# EAGLE design base (EAGLE 9.6.2)

## Sheet 1 of 3
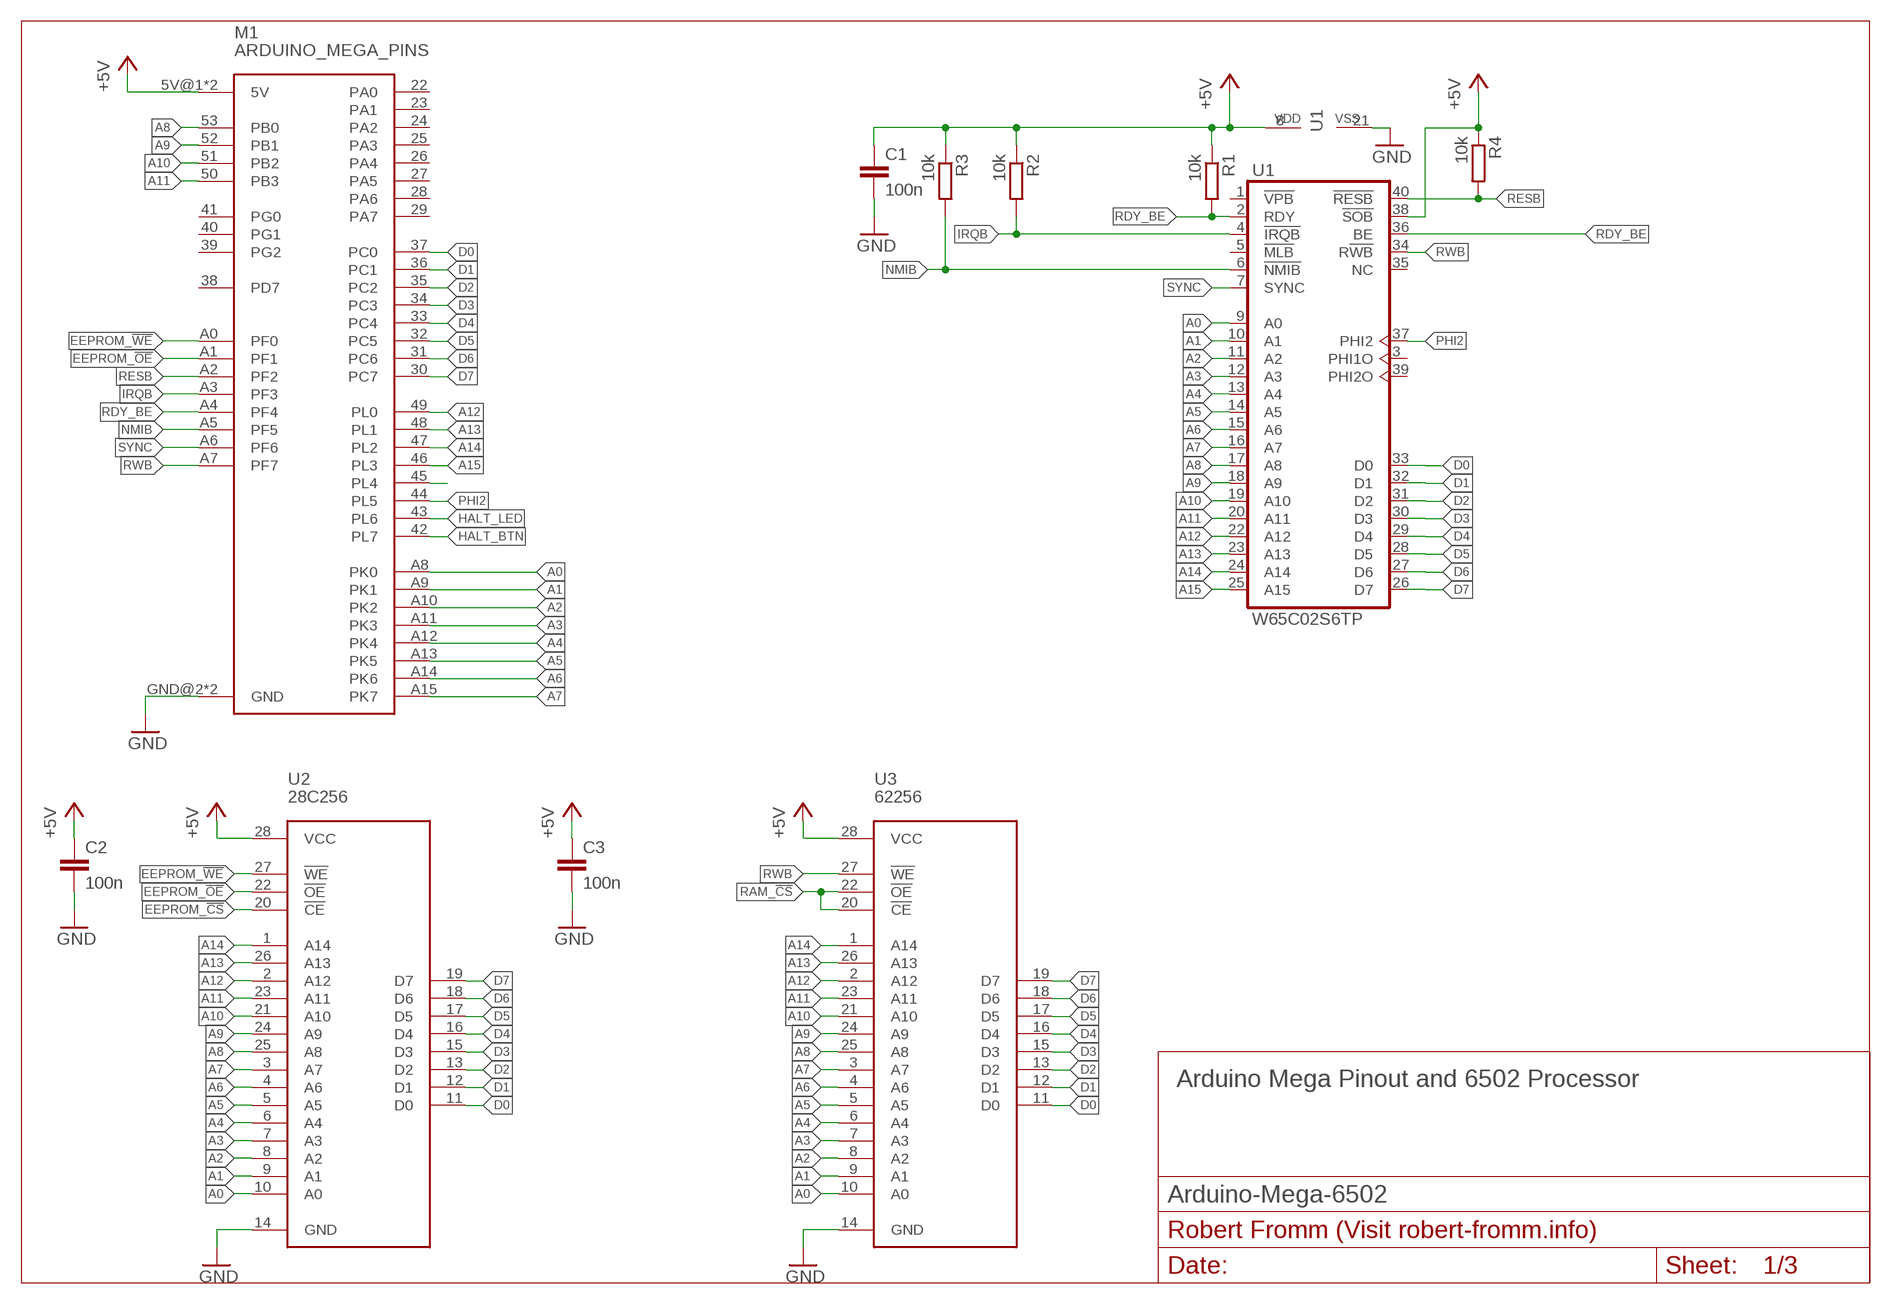
[diagram p0: schematic, sheet 1]

### Parts
C1  100n  C-EUC0805  [C0805]
C2  100n  C-EUC0805  [C0805]
C3  100n  C-EUC0805  [C0805]
M1  ARDUINO_MEGA_PINS  [ARDUINO_MEGA_PINS]
R1  10k  R-EU_R0805  [R0805]
R2  10k  R-EU_R0805  [R0805]
R3  10k  R-EU_R0805  [R0805]
R4  10k  R-EU_R0805  [R0805]
U1  W65C02S6TP  [DIL40]
U2  28C256  [DIL28-6]
U3  62256  [DIL28-6]

### Nets
+5V: C1.1 C2.1 C3.1 M1.5V@1(5V) M1.5V@2(5V) R1.1 R2.1 R3.1 R4.1 U1.8(P:VDD) U1.38(1:!SOB) U2.28(VCC) U3.28(VCC) ; also sheet 2,3
A0: M1.A8(PK0) U1.9(1:A0) U2.10(A0) U3.10(A0) ; also sheet 3
A1: M1.A9(PK1) U1.10(1:A1) U2.9(A1) U3.9(A1) ; also sheet 3
A2: M1.A10(PK2) U1.11(1:A2) U2.8(A2) U3.8(A2) ; also sheet 3
A3: M1.A11(PK3) U1.12(1:A3) U2.7(A3) U3.7(A3) ; also sheet 3
A4: M1.A12(PK4) U1.13(1:A4) U2.6(A4) U3.6(A4) ; also sheet 3
A5: M1.A13(PK5) U1.14(1:A5) U2.5(A5) U3.5(A5) ; also sheet 3
A6: M1.A14(PK6) U1.15(1:A6) U2.4(A6) U3.4(A6) ; also sheet 3
A7: M1.A15(PK7) U1.16(1:A7) U2.3(A7) U3.3(A7) ; also sheet 3
A8: M1.53(PB0) U1.17(1:A8) U2.25(A8) U3.25(A8) ; also sheet 3
A9: M1.52(PB1) U1.18(1:A9) U2.24(A9) U3.24(A9) ; also sheet 3
A10: M1.51(PB2) U1.19(1:A10) U2.21(A10) U3.21(A10) ; also sheet 3
A11: M1.50(PB3) U1.20(1:A11) U2.23(A11) U3.23(A11) ; also sheet 3
A12: M1.49(PL0) U1.22(1:A12) U2.2(A12) U3.2(A12) ; also sheet 2,3
A13: M1.48(PL1) U1.23(1:A13) U2.26(A13) U3.26(A13) ; also sheet 2,3
A14: M1.47(PL2) U1.24(1:A14) U2.1(A14) U3.1(A14) ; also sheet 2,3
A15: M1.46(PL3) U1.25(1:A15) ; also sheet 2,3
D0: M1.37(PC0) U1.33(1:D0) U2.11(D0) U3.11(D0) ; also sheet 3
D1: M1.36(PC1) U1.32(1:D1) U2.12(D1) U3.12(D1) ; also sheet 3
D2: M1.35(PC2) U1.31(1:D2) U2.13(D2) U3.13(D2) ; also sheet 3
D3: M1.34(PC3) U1.30(1:D3) U2.15(D3) U3.15(D3) ; also sheet 3
D4: M1.33(PC4) U1.29(1:D4) U2.16(D4) U3.16(D4) ; also sheet 3
D5: M1.32(PC5) U1.28(1:D5) U2.17(D5) U3.17(D5) ; also sheet 3
D6: M1.31(PC6) U1.27(1:D6) U2.18(D6) U3.18(D6) ; also sheet 3
D7: M1.30(PC7) U1.26(1:D7) U2.19(D7) U3.19(D7) ; also sheet 3
EEPROM_!CS: U2.20(!CE) ; also sheet 2
EEPROM_!OE: M1.A1(PF1) U2.22(!OE)
EEPROM_!WE: M1.A0(PF0) U2.27(!WE)
GND: C1.2 C2.2 C3.2 M1.GND@2(GND) M1.GND@3(GND) U1.21(P:VSS) U2.14(GND) U3.14(GND) ; also sheet 2,3
HALT_BTN: M1.42(PL7) ; also sheet 3
HALT_LED: M1.43(PL6) ; also sheet 3
IRQB: M1.A3(PF3) R2.2 U1.4(1:!IRQB) ; also sheet 3
N$6: M1.45(PL4)
NMIB: M1.A5(PF5) R3.2 U1.6(1:!NMIB) ; also sheet 3
PHI2: M1.44(PL5) U1.37(1:PHI2) ; also sheet 2,3
RAM_!CS: U3.20(!CE) U3.22(!OE) ; also sheet 2
RDY_BE: M1.A4(PF4) R1.2 U1.2(1:RDY) U1.36(1:BE)
RESB: M1.A2(PF2) R4.2 U1.40(1:!RESB) ; also sheet 3
RWB: M1.A7(PF7) U1.34(1:R!WB) U3.27(!WE) ; also sheet 3
SYNC: M1.A6(PF6) U1.7(1:SYNC) ; also sheet 3
Unconnected: M1.22(PA0) M1.23(PA1) M1.24(PA2) M1.25(PA3) M1.26(PA4) M1.27(PA5) M1.28(PA6) M1.29(PA7) M1.38(PD7) M1.39(PG2) M1.40(PG1) M1.41(PG0) U1.1(1:!VPB) U1.3(1:PHI1O) U1.5(1:!MLB) U1.35(1:NC) U1.39(1:PHI2O)

### Notes on the sheet
- Arduino Mega Pinout and 6502 Processor

## Sheet 2 of 3
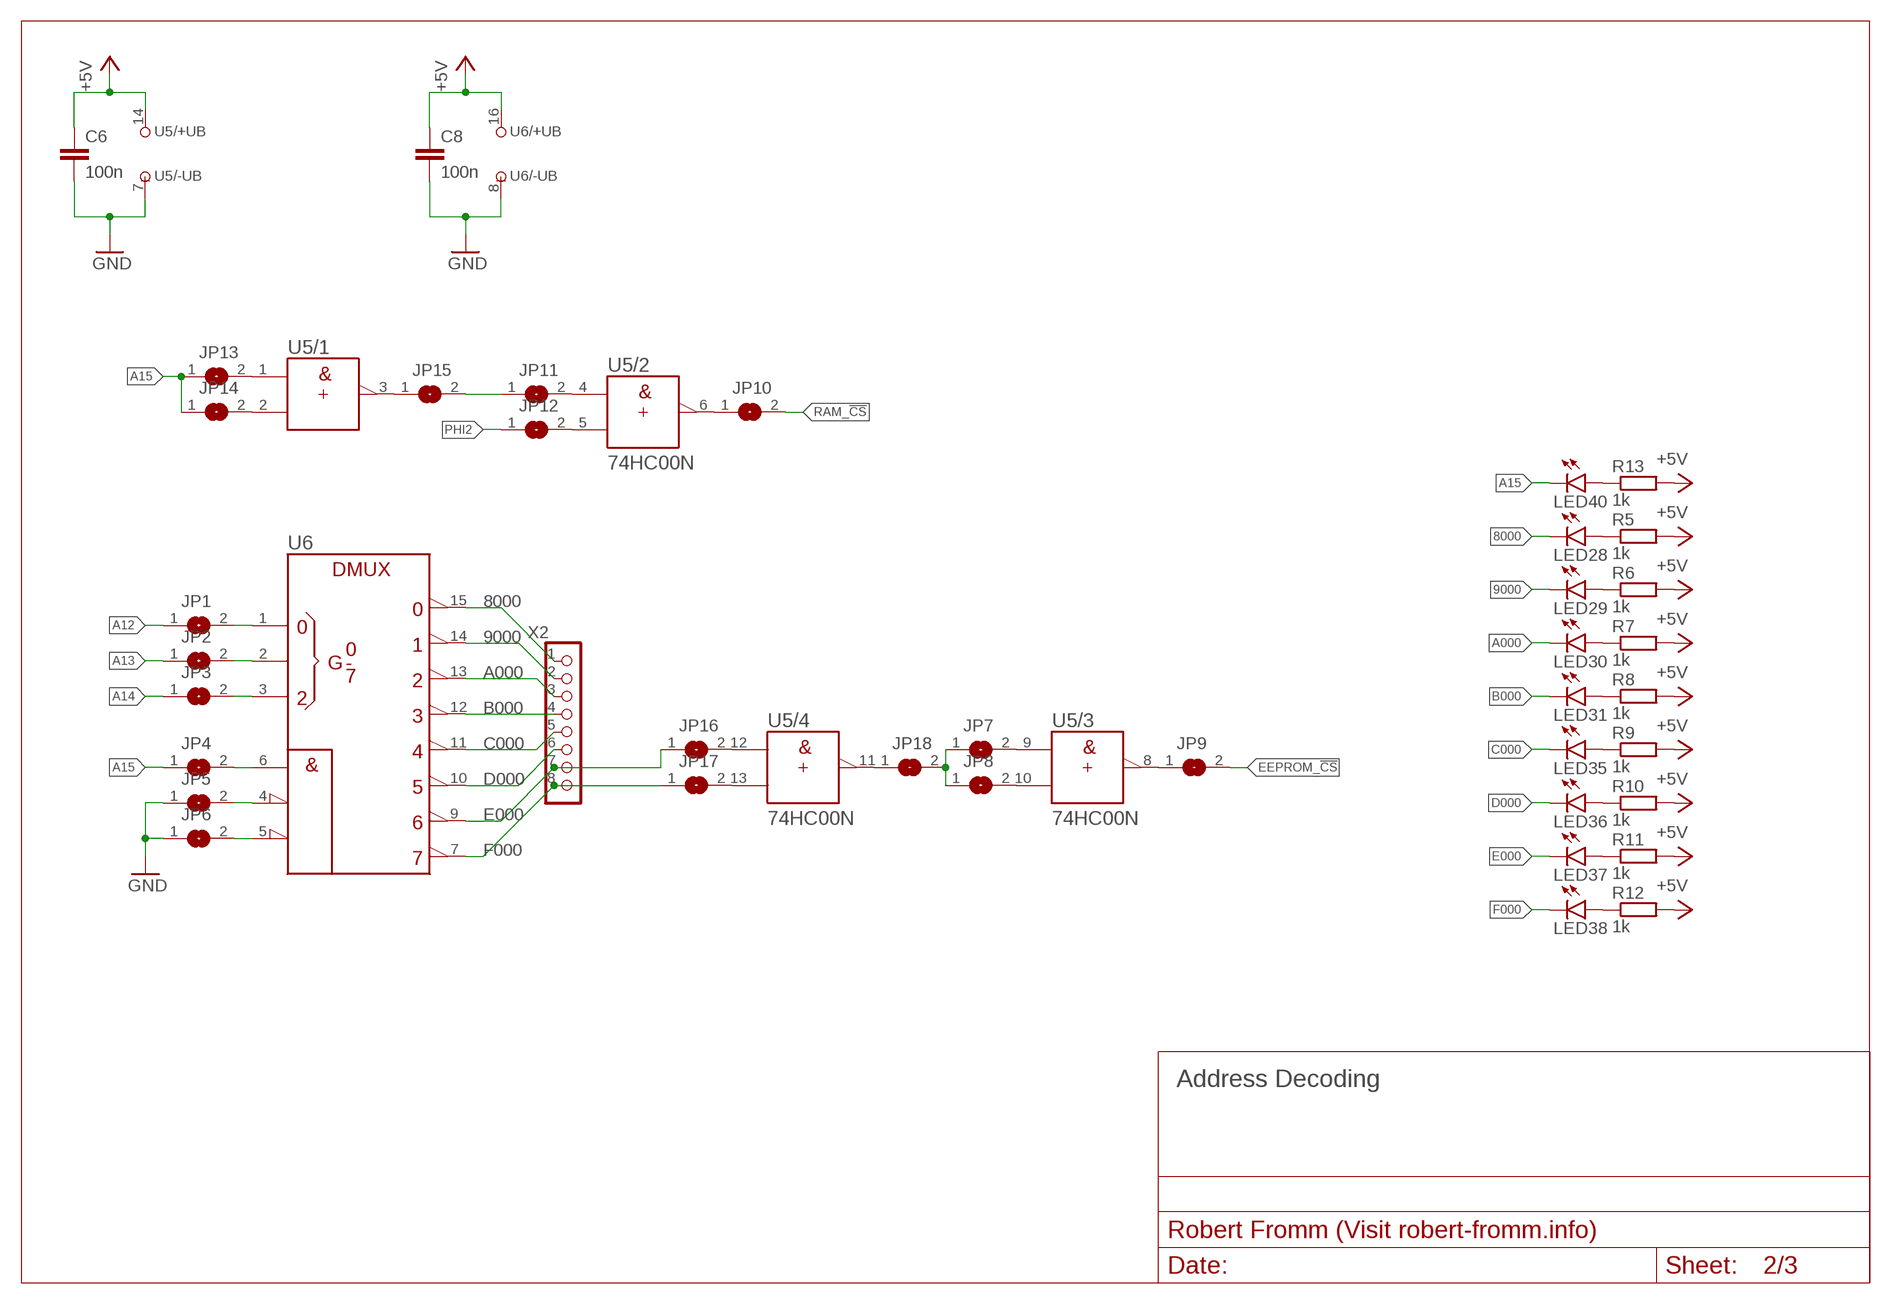
[diagram p1: schematic, sheet 2]

### Parts
C6  100n  C-EUC0805  [C0805]
C8  100n  C-EUC0805  [C0805]
JP1  SJ  [SJ]
JP2  SJ  [SJ]
JP3  SJ  [SJ]
JP4  SJ  [SJ]
JP5  SJ  [SJ]
JP6  SJ  [SJ]
JP7  SJ  [SJ]
JP8  SJ  [SJ]
JP9  SJ  [SJ]
JP10  SJ  [SJ]
JP11  SJ  [SJ]
JP12  SJ  [SJ]
JP13  SJ  [SJ]
JP14  SJ  [SJ]
JP15  SJ  [SJ]
JP16  SJ  [SJ]
JP17  SJ  [SJ]
JP18  SJ  [SJ]
LED28  LEDSML0805  [SML0805]
LED29  LEDSML0805  [SML0805]
LED30  LEDSML0805  [SML0805]
LED31  LEDSML0805  [SML0805]
LED35  LEDSML0805  [SML0805]
LED36  LEDSML0805  [SML0805]
LED37  LEDSML0805  [SML0805]
LED38  LEDSML0805  [SML0805]
LED40  LEDSML0805  [SML0805]
R5  1k  R-EU_R0805  [R0805]
R6  1k  R-EU_R0805  [R0805]
R7  1k  R-EU_R0805  [R0805]
R8  1k  R-EU_R0805  [R0805]
R9  1k  R-EU_R0805  [R0805]
R10  1k  R-EU_R0805  [R0805]
R11  1k  R-EU_R0805  [R0805]
R12  1k  R-EU_R0805  [R0805]
R13  1k  R-EU_R0805  [R0805]
U5  74HC00N  [DIL14]
U6  74138N  [DIL16]
X2  PINHD_8_RND  [1X08]

### Nets
8000: LED28.C U6.15(Y0) X2.1
9000: LED29.C U6.14(Y1) X2.2
+5V: C6.1 C8.1 R5.2 R6.2 R7.2 R8.2 R9.2 R10.2 R11.2 R12.2 R13.2 U5.14(/+UB:+UB) U6.16(+UB) ; also sheet 1,3
A000: LED30.C U6.13(Y2) X2.3
A12: JP1.1 ; also sheet 1,3
A13: JP2.1 ; also sheet 1,3
A14: JP3.1 ; also sheet 1,3
A15: JP4.1 JP13.1 JP14.1 LED40.C ; also sheet 1,3
B000: LED31.C U6.12(Y3) X2.4
C000: LED35.C U6.11(Y4) X2.5
D000: LED36.C U6.10(Y5) X2.6
E000: JP16.1 LED37.C U6.9(Y6) X2.7
EEPROM_!CS: JP9.2 ; also sheet 1
F000: JP17.1 LED38.C U6.7(Y7) X2.8
GND: C6.2 C8.2 JP5.1 JP6.1 U5.7(/-UB:-UB) U6.8(-UB) ; also sheet 1,3
N$1: LED40.A R13.1
N$9: JP7.2 U5.9(/3:A)
N$10: JP8.2 U5.10(/3:B)
N$11: JP9.1 U5.8(/3:Y)
N$12: JP1.2 U6.1(A)
N$13: JP2.2 U6.2(B)
N$14: JP3.2 U6.3(C)
N$15: JP5.2 U6.4(!G2A)
N$16: JP6.2 U6.5(!G2B)
N$17: JP4.2 U6.6(G1)
N$18: JP17.2 U5.13(/4:B)
N$19: JP10.1 U5.6(/2:Y)
N$20: JP13.2 U5.1(/1:A)
N$21: JP14.2 U5.2(/1:B)
N$49: JP15.1 U5.3(/1:Y)
N$50: JP18.1 U5.11(/4:Y)
N$51: JP11.1 JP15.2
N$52: JP16.2 U5.12(/4:A)
N$53: JP7.1 JP8.1 JP18.2
N$55: JP11.2 U5.4(/2:A)
N$56: JP12.2 U5.5(/2:B)
N$57: LED28.A R5.1
N$58: LED29.A R6.1
N$59: LED30.A R7.1
N$60: LED31.A R8.1
N$61: LED35.A R9.1
N$62: LED36.A R10.1
N$63: LED37.A R11.1
N$64: LED38.A R12.1
PHI2: JP12.1 ; also sheet 1,3
RAM_!CS: JP10.2 ; also sheet 1

### Notes on the sheet
- Address Decoding

## Sheet 3 of 3
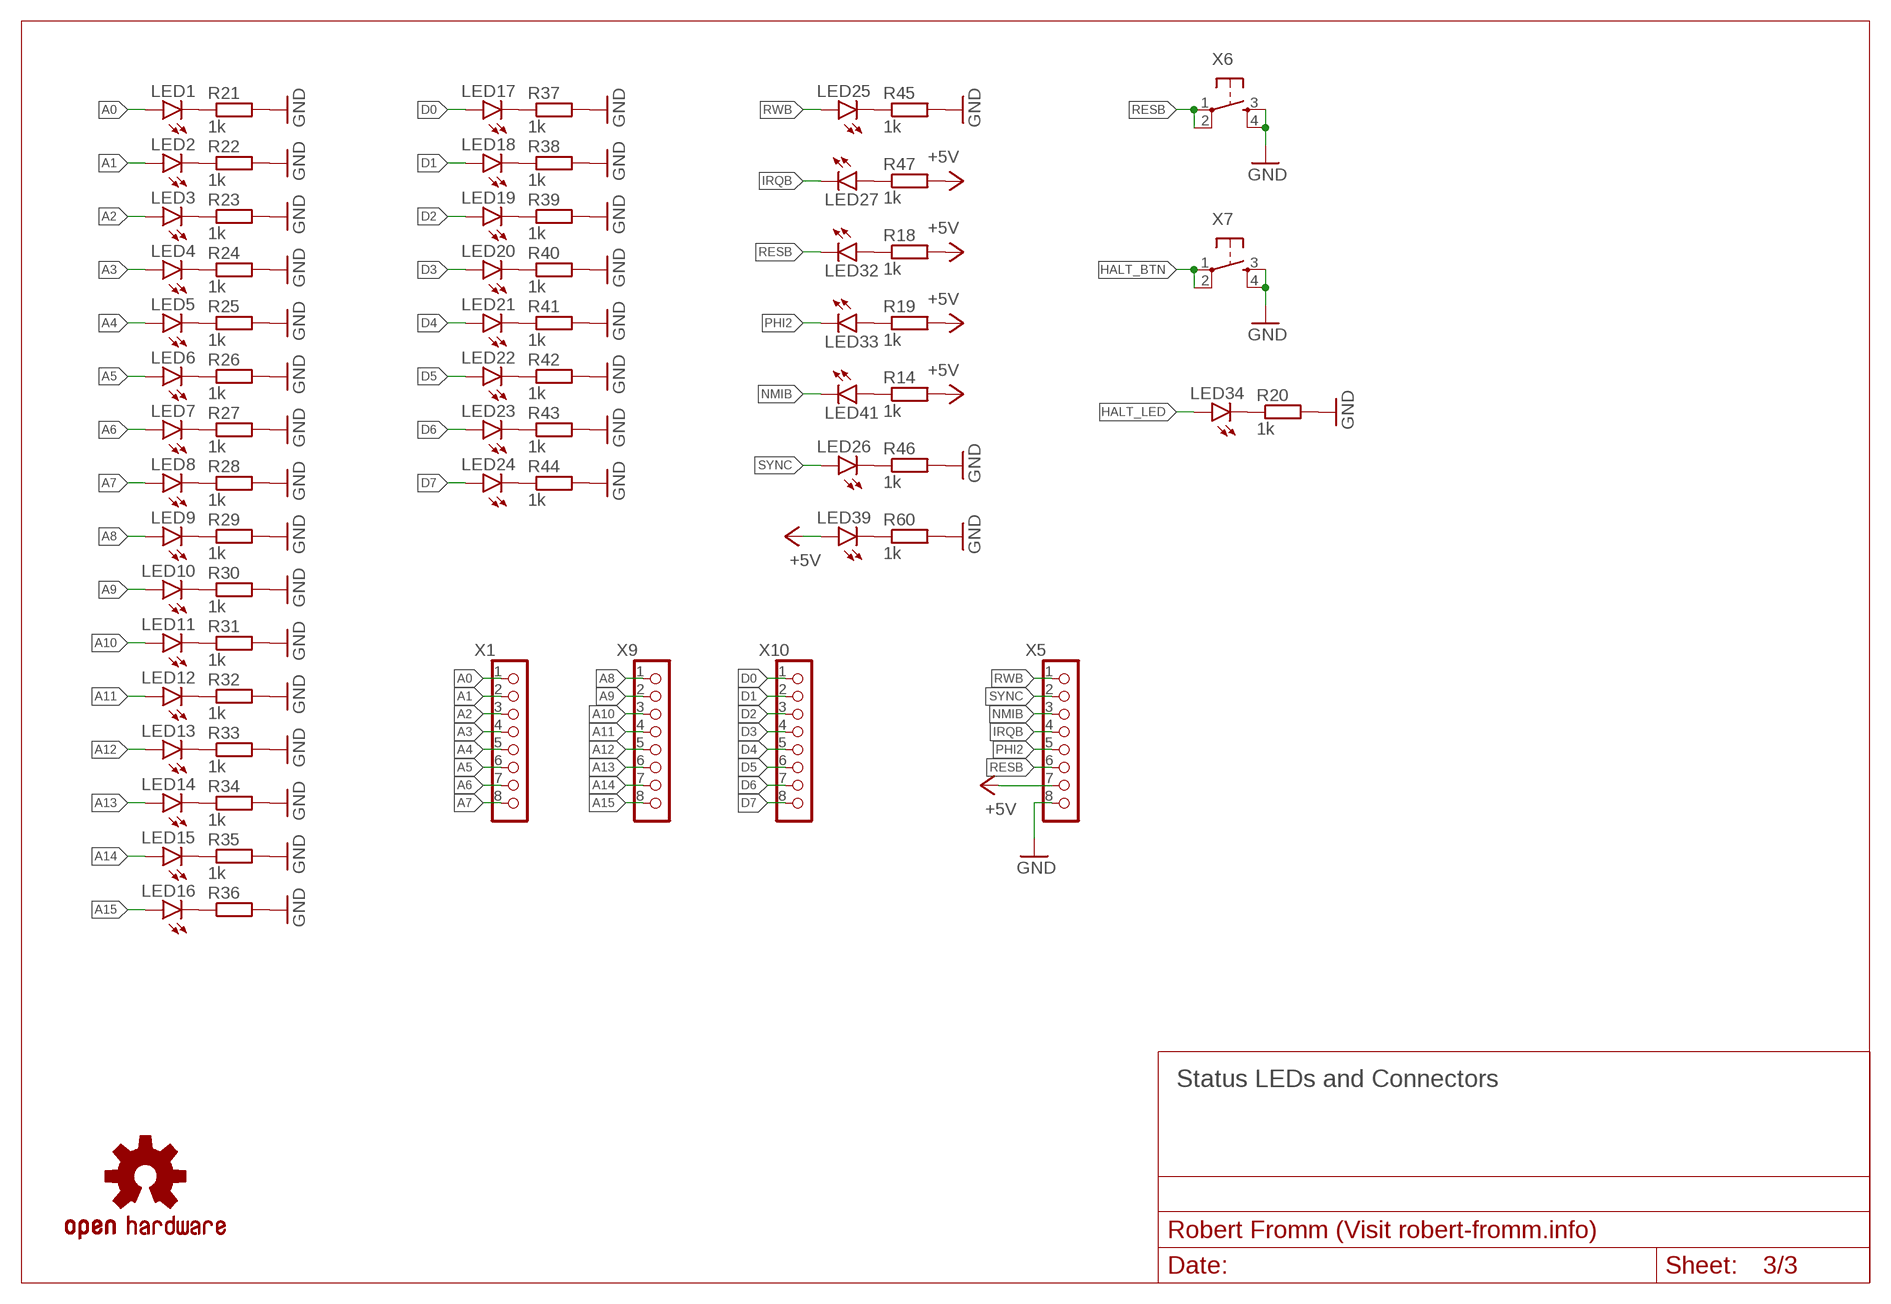
[diagram p2: schematic, sheet 3]

### Parts
LED1  LEDSML0805  [SML0805]
LED2  LEDSML0805  [SML0805]
LED3  LEDSML0805  [SML0805]
LED4  LEDSML0805  [SML0805]
LED5  LEDSML0805  [SML0805]
LED6  LEDSML0805  [SML0805]
LED7  LEDSML0805  [SML0805]
LED8  LEDSML0805  [SML0805]
LED9  LEDSML0805  [SML0805]
LED10  LEDSML0805  [SML0805]
LED11  LEDSML0805  [SML0805]
LED12  LEDSML0805  [SML0805]
LED13  LEDSML0805  [SML0805]
LED14  LEDSML0805  [SML0805]
LED15  LEDSML0805  [SML0805]
LED16  LEDSML0805  [SML0805]
LED17  LEDSML0805  [SML0805]
LED18  LEDSML0805  [SML0805]
LED19  LEDSML0805  [SML0805]
LED20  LEDSML0805  [SML0805]
LED21  LEDSML0805  [SML0805]
LED22  LEDSML0805  [SML0805]
LED23  LEDSML0805  [SML0805]
LED24  LEDSML0805  [SML0805]
LED25  LEDSML0805  [SML0805]
LED26  LEDSML0805  [SML0805]
LED27  LEDSML0805  [SML0805]
LED32  LEDSML0805  [SML0805]
LED33  LEDSML0805  [SML0805]
LED34  LEDSML0805  [SML0805]
LED39  LEDSML0805  [SML0805]
LED41  LEDSML0805  [SML0805]
LOGO1  OSHW-LOGOM  [OSHW-LOGO-M]
R14  1k  R-EU_R0805  [R0805]
R18  1k  R-EU_R0805  [R0805]
R19  1k  R-EU_R0805  [R0805]
R20  1k  R-EU_R0805  [R0805]
R21  1k  R-EU_R0805  [R0805]
R22  1k  R-EU_R0805  [R0805]
R23  1k  R-EU_R0805  [R0805]
R24  1k  R-EU_R0805  [R0805]
R25  1k  R-EU_R0805  [R0805]
R26  1k  R-EU_R0805  [R0805]
R27  1k  R-EU_R0805  [R0805]
R28  1k  R-EU_R0805  [R0805]
R29  1k  R-EU_R0805  [R0805]
R30  1k  R-EU_R0805  [R0805]
R31  1k  R-EU_R0805  [R0805]
R32  1k  R-EU_R0805  [R0805]
R33  1k  R-EU_R0805  [R0805]
R34  1k  R-EU_R0805  [R0805]
R35  1k  R-EU_R0805  [R0805]
R36  1k  R-EU_R0805  [R0805]
R37  1k  R-EU_R0805  [R0805]
R38  1k  R-EU_R0805  [R0805]
R39  1k  R-EU_R0805  [R0805]
R40  1k  R-EU_R0805  [R0805]
R41  1k  R-EU_R0805  [R0805]
R42  1k  R-EU_R0805  [R0805]
R43  1k  R-EU_R0805  [R0805]
R44  1k  R-EU_R0805  [R0805]
R45  1k  R-EU_R0805  [R0805]
R46  1k  R-EU_R0805  [R0805]
R47  1k  R-EU_R0805  [R0805]
R60  1k  R-EU_R0805  [R0805]
X1  PINHD_8_RND  [1X08]
X5  PINHD_8_RND  [1X08]
X6  TACT_SWITCH  [TACTILE_SWITCH_PTH_6.0MM]
X7  TACT_SWITCH  [TACTILE_SWITCH_PTH_6.0MM]
X9  PINHD_8_RND  [1X08]
X10  PINHD_8_RND  [1X08]

### Nets
+5V: LED39.A R14.2 R18.2 R19.2 R47.2 X5.7 ; also sheet 1,2
A0: LED1.A X1.1 ; also sheet 1
A1: LED2.A X1.2 ; also sheet 1
A2: LED3.A X1.3 ; also sheet 1
A3: LED4.A X1.4 ; also sheet 1
A4: LED5.A X1.5 ; also sheet 1
A5: LED6.A X1.6 ; also sheet 1
A6: LED7.A X1.7 ; also sheet 1
A7: LED8.A X1.8 ; also sheet 1
A8: LED9.A X9.1 ; also sheet 1
A9: LED10.A X9.2 ; also sheet 1
A10: LED11.A X9.3 ; also sheet 1
A11: LED12.A X9.4 ; also sheet 1
A12: LED13.A X9.5 ; also sheet 1,2
A13: LED14.A X9.6 ; also sheet 1,2
A14: LED15.A X9.7 ; also sheet 1,2
A15: LED16.A X9.8 ; also sheet 1,2
D0: LED17.A X10.1 ; also sheet 1
D1: LED18.A X10.2 ; also sheet 1
D2: LED19.A X10.3 ; also sheet 1
D3: LED20.A X10.4 ; also sheet 1
D4: LED21.A X10.5 ; also sheet 1
D5: LED22.A X10.6 ; also sheet 1
D6: LED23.A X10.7 ; also sheet 1
D7: LED24.A X10.8 ; also sheet 1
GND: R20.2 R21.2 R22.2 R23.2 R24.2 R25.2 R26.2 R27.2 R28.2 R29.2 R30.2 R31.2 R32.2 R33.2 R34.2 R35.2 R36.2 R37.2 R38.2 R39.2 R40.2 R41.2 R42.2 R43.2 R44.2 R45.2 R46.2 R60.2 X5.8 X6.3 X6.4 X7.3 X7.4 ; also sheet 1,2
HALT_BTN: X7.1 X7.2 ; also sheet 1
HALT_LED: LED34.A ; also sheet 1
IRQB: LED27.C X5.4 ; also sheet 1
N$2: LED41.A R14.1
N$22: LED1.C R21.1
N$23: LED2.C R22.1
N$24: LED3.C R23.1
N$25: LED4.C R24.1
N$26: LED5.C R25.1
N$27: LED6.C R26.1
N$28: LED7.C R27.1
N$29: LED8.C R28.1
N$30: LED9.C R29.1
N$31: LED10.C R30.1
N$32: LED11.C R31.1
N$33: LED12.C R32.1
N$34: LED13.C R33.1
N$35: LED14.C R34.1
N$36: LED15.C R35.1
N$37: LED16.C R36.1
N$38: LED17.C R37.1
N$39: LED18.C R38.1
N$40: LED19.C R39.1
N$41: LED20.C R40.1
N$42: LED21.C R41.1
N$43: LED22.C R42.1
N$44: LED23.C R43.1
N$45: LED24.C R44.1
N$46: LED25.C R45.1
N$47: LED26.C R46.1
N$48: LED27.A R47.1
N$54: LED39.C R60.1
N$65: LED32.A R18.1
N$66: LED33.A R19.1
N$67: LED34.C R20.1
NMIB: LED41.C X5.3 ; also sheet 1
PHI2: LED33.C X5.5 ; also sheet 1,2
RESB: LED32.C X5.6 X6.1 X6.2 ; also sheet 1
RWB: LED25.A X5.1 ; also sheet 1
SYNC: LED26.A X5.2 ; also sheet 1

### Notes on the sheet
- Status LEDs and Connectors

## Library data of the parts
C1-C3 C6 C8 = rcl:C-EU: CAPACITOR, European symbol; SPICEPREFIX: C
JP1-JP18 = 6502_lib:SJ: SMD solder JUMPER
LED1-LED41 = led:LED: LED OSRAM: - CHIPLED LG R971, LG N971, LY N971, LG Q971, LY Q971, LO R971, LY R971 LH N974, LH R974 LS Q976, LO Q976, LY Q976 LO Q996 - Hyper CHIPLED LW Q18S LB Q993, LB Q99A, LB R99A - SideLED LS A670, LO A670, LY A670, LG A670, LP A670 LB A673, LV A673, LT A673, LW A673 LH A674 LY A675 LS A676, LA A676, LO A676, LY A676, LW A676 LS A679, LY A679, LG A679 - Hyper Micro SIDELED® LS Y876, LA Y876, LO Y876, LY Y876 LT Y87S - SmartLED LW L88C, LW L88S LB L89C, LB L89S, LG L890 LS L89K, LO L89K, LY L89K LS L896, LA L896, LO L896, LY L896 - TOPLED LS T670, LO T670, LY T670, LG T670, LP T670 LSG T670, LSP T670, LSY T670, LOP T670, LYG T670 LG T671, LOG T671, LSG T671 LB T673, LV T673, LT T673, LW T673 LH T674 LS T676, LA T676, LO T676, LY T676, LB T676, LH T676, LSB T676, LW T676 LB T67C, LV T67C, LT T67C, LS T67K, LO T67K, LY T67K, LW E67C LS E67B, LA E67B, LO E67B, LY E67B, LB E67C, LV E67C, LT E67C LW T67C LS T679, LY T679, LG T679 LS T770, LO T770, LY T770, LG T770, LP T770 LB T773, LV T773, LT T773, LW T773 LH T774 LS E675, LA E675, LY E675, LS T675 LS T776, LA T776, LO T776, LY T776, LB T776 LHGB T686 LT T68C, LB T68C - Hyper Mini TOPLED® LB M676 - Mini TOPLED Santana® LG M470 LS M47K, LO M47K, LY M47K Source: http://www.osram.convergy.de LUXEON: - LUMILED® LXK2-PW12-R00, LXK2-PW12-S00, LXK2-PW14-U00, LXK2-PW14-V00 LXK2-PM12-R00, LXK2-PM12-S00, LXK2-PM14-U00 LXK2-PE12-Q00, LXK2-PE12-R00, LXK2-PE12-S00, LXK2-PE14-T00, LXK2-PE14-U00 LXK2-PB12-K00, LXK2-PB12-L00, LXK2-PB12-M00, LXK2-PB14-N00, LXK2-PB14-P00, LXK2-PB14-Q00 LXK2-PR12-L00, LXK2-PR12-M00, LXK2-PR14-Q00, LXK2-PR14-R00 LXK2-PD12-Q00, LXK2-PD12-R00, LXK2-PD12-S00 LXK2-PH12-R00, LXK2-PH12-S00 LXK2-PL12-P00, LXK2-PL12-Q00, LXK2-PL12-R00 Source: www.luxeon.com KINGBRIGHT: KA-3528ASYC Source: www.kingbright.com
LOGO1 = SparkFun-Aesthetics:OSHW-LOGO: Open-Source Hardware (OSHW) Logo This logo indicates the piece of hardware it is found on incorporates a OSHW license and/or adheres to the definition of open source hardware found here: http://freedomdefined.org/OSHW
M1 = 6502_lib:ARDUINO_MEGA_PINS
R1-R14 R18-R47 R60 = rcl:R-EU_: RESISTOR, European symbol; SPICEPREFIX: R
U1 = 6502_lib:W65C02S: W65C02 by WDC
U2 = 6502_lib:28C256
U3 = 6502_lib:62256
U5 = 6502_lib:74*00: Quad 2-input NAND gate
U6 = 6502_lib:74*138: 3-line to 8-line DECODER/DEMULTIPLEXER
X1 X2 X5 X9 X10 = 6502_lib:PINHD_8_RND: PIN HEADER
X6 X7 = 6502_lib:TACT_SWITCH

## Board
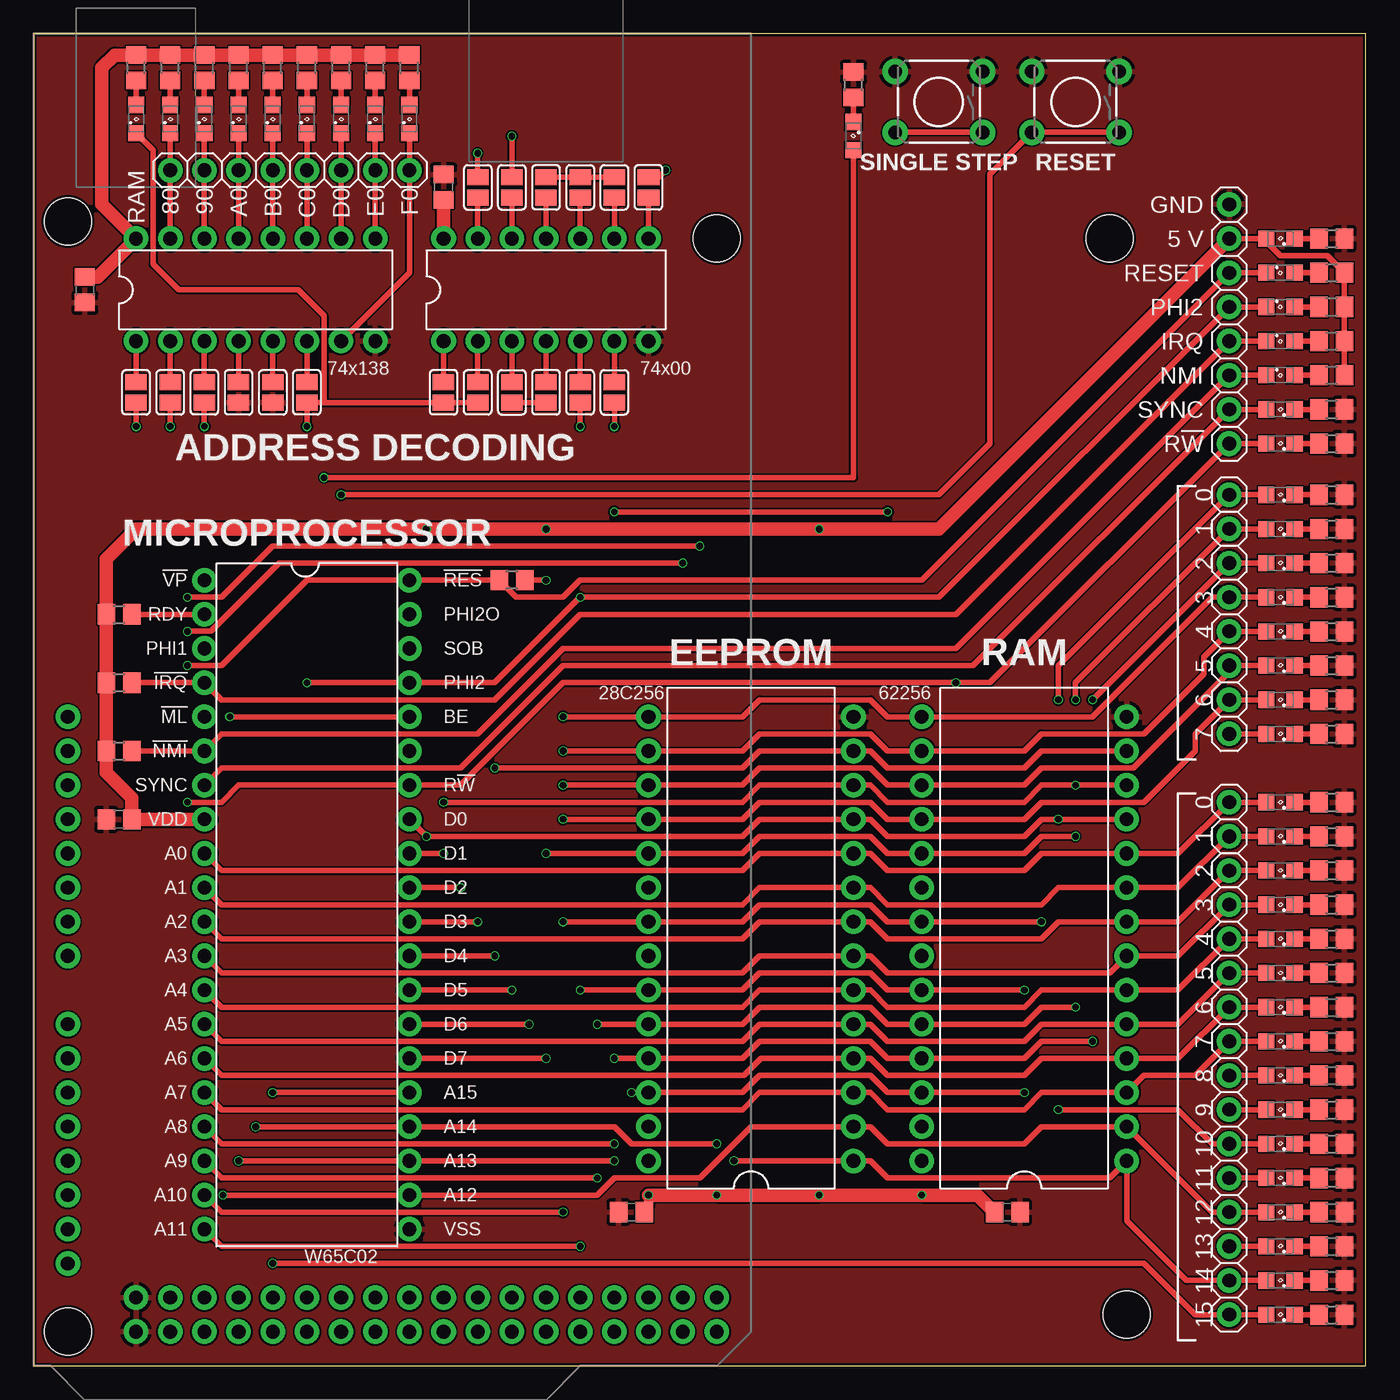
[diagram p3: board, top side]
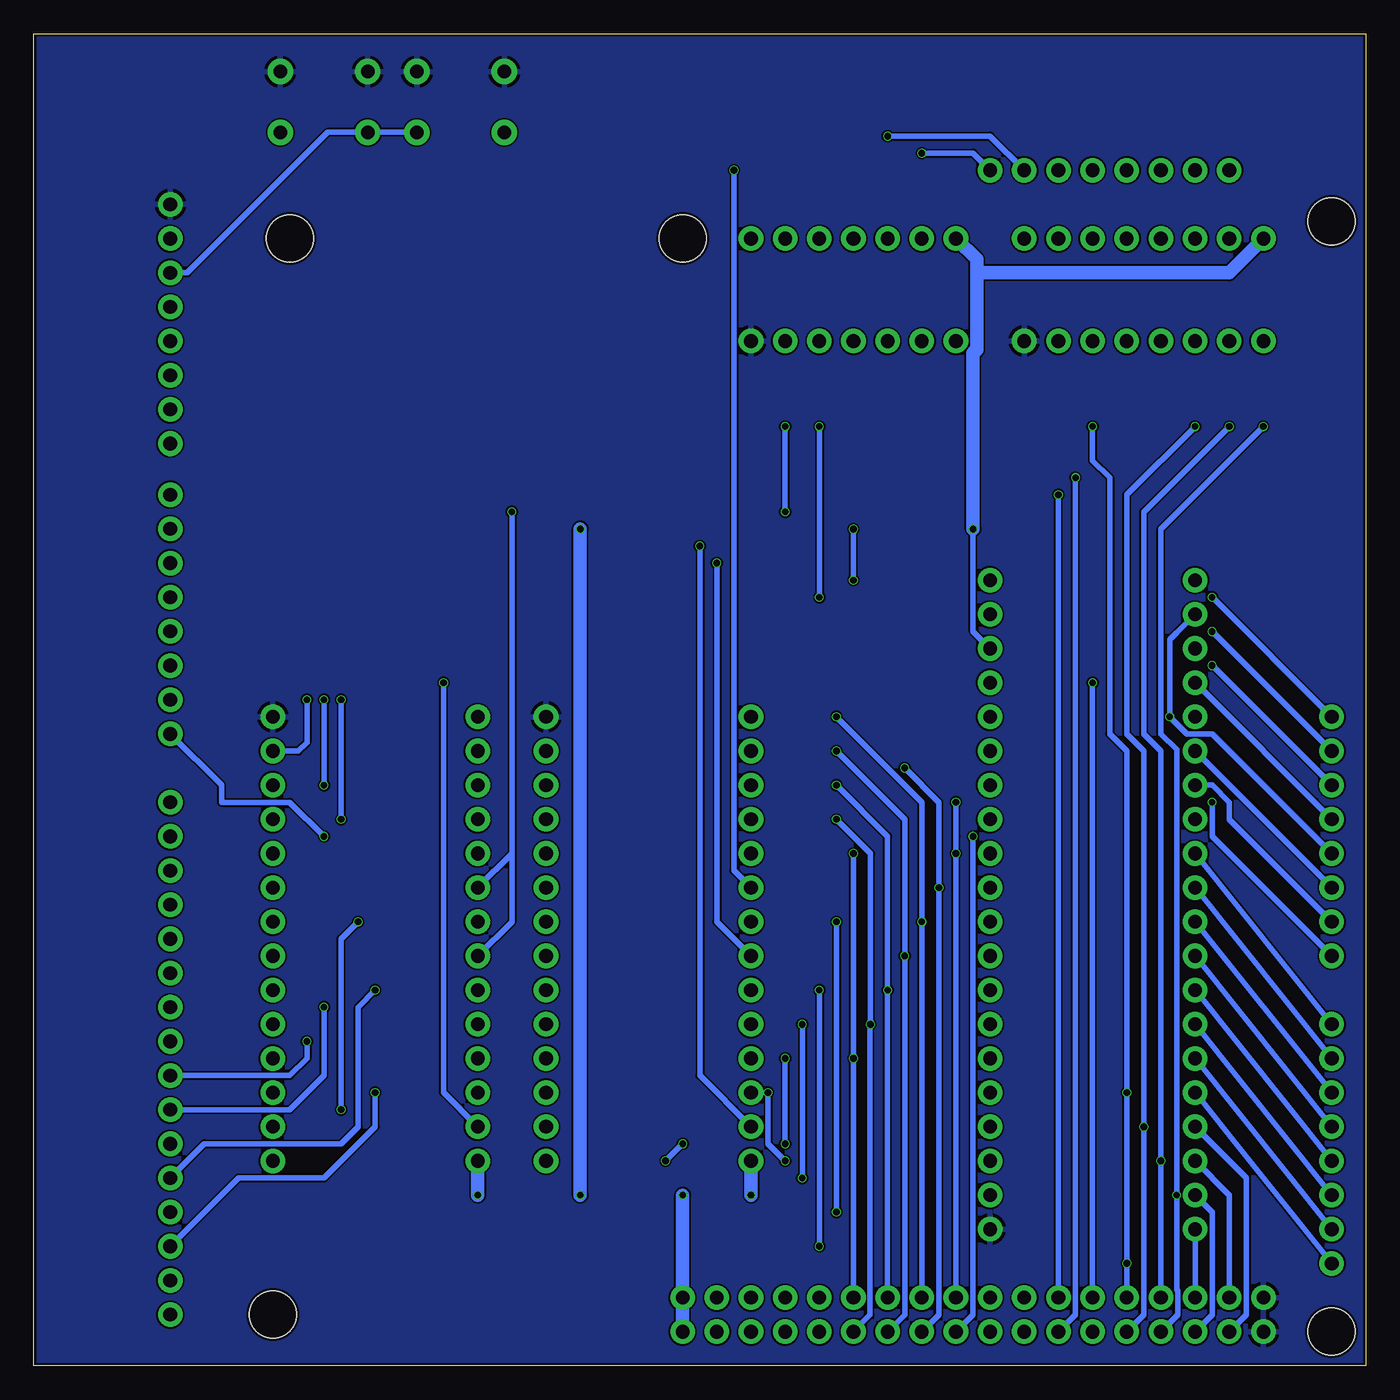
[diagram p4: board, bottom side, seen from below]

Size 99.06 x 99.06 mm. Coordinates in mm from the lower left corner, seen from the top.
Outline: 99.06,0 99.06,99.06 0,99.06 0,0 99.06,0
Copper layers (1*16): Top 0.035mm / dielectric 1.6mm / Bottom 0.035mm
Design rules "jlcpcb-2layers *": minimum track width 5mil, minimum drill 0.3mm, track to track 5mil, track to pad 5mil, pad to pad 5mil, via to via 5mil, smd to smd 5mil, copper to edge 0.2mm, drill to drill 6mil, minimum pad ring 10mil, minimum via ring 3mil, stop-mask expansion 4mil, vias tented up to drill 0.5mm, thermal gap 10mil
Holes 3.5 mm at 81.28,3.81 80.01,83.82

### Footprints (pad centres in the part's own frame; a part is rotated, then mirrored left to right if it is on the bottom)
C0805 = smd 1.3 x 1.5: 1 -0.95,0; 2 0.95,0
SJ = smd 1.168 x 1.6: 1 -0.762,0; 2 0.762,0
SML0805 = smd 1.2 x 1.2: A 1.05,0; C -1.05,0
ARDUINO_MEGA_PINS = drill 1.016 pad 1.778: 5V@1 44.45,24.13; 5V@2 46.99,24.13; 22 44.45,21.59; 23 46.99,21.59; 24 44.45,19.05; 25 46.99,19.05; 26 44.45,16.51; 27 46.99,16.51; 28 44.45,13.97; 29 46.99,13.97; 30 44.45,11.43; 31 46.99,11.43; 32 44.45,8.89; 33 46.99,8.89; 34 44.45,6.35; 35 46.99,6.35; 36 44.45,3.81; 37 46.99,3.81; 38 44.45,1.27; 39 46.99,1.27; 40 44.45,-1.27; 41 46.99,-1.27; 42 44.45,-3.81; 43 46.99,-3.81; 44 44.45,-6.35; 45 46.99,-6.35; 46 44.45,-8.89; 47 46.99,-8.89; 48 44.45,-11.43; 49 46.99,-11.43; 50 44.45,-13.97; 51 46.99,-13.97; 52 44.45,-16.51; 53 46.99,-16.51; A0 1.27,-24.13; A1 3.81,-24.13; A2 6.35,-24.13; A3 8.89,-24.13; A4 11.43,-24.13; A5 13.97,-24.13; A6 16.51,-24.13; A7 19.05,-24.13; A8 24.13,-24.13; A9 26.67,-24.13; A10 29.21,-24.13; A11 31.75,-24.13; A12 34.29,-24.13; A13 36.83,-24.13; A14 39.37,-24.13; A15 41.91,-24.13; GND@2 44.45,-19.05; GND@3 46.99,-19.05 | hole 3.5: -34.29,24.13; -35.56,-24.13; 46.99,-24.13
R0805 = smd 1.3 x 1.5: 1 -0.95,0; 2 0.95,0
DIL40 = drill 1.016 pad 1.778: 1 -24.13,-7.62; 2 -21.59,-7.62; 3 -19.05,-7.62; 4 -16.51,-7.62; 5 -13.97,-7.62; 6 -11.43,-7.62; 7 -8.89,-7.62; 8 -6.35,-7.62; 9 -3.81,-7.62; 10 -1.27,-7.62; 11 1.27,-7.62; 12 3.81,-7.62; 13 6.35,-7.62; 14 8.89,-7.62; 15 11.43,-7.62; 16 13.97,-7.62; 17 16.51,-7.62; 18 19.05,-7.62; 19 21.59,-7.62; 20 24.13,-7.62; 21 24.13,7.62; 22 21.59,7.62; 23 19.05,7.62; 24 16.51,7.62; 25 13.97,7.62; 26 11.43,7.62; 27 8.89,7.62; 28 6.35,7.62; 29 3.81,7.62; 30 1.27,7.62; 31 -1.27,7.62; 32 -3.81,7.62; 33 -6.35,7.62; 34 -8.89,7.62; 35 -11.43,7.62; 36 -13.97,7.62; 37 -16.51,7.62; 38 -19.05,7.62; 39 -21.59,7.62; 40 -24.13,7.62
DIL28-6 = drill 1.016 pad 1.778: 1 -16.51,-7.62; 2 -13.97,-7.62; 3 -11.43,-7.62; 4 -8.89,-7.62; 5 -6.35,-7.62; 6 -3.81,-7.62; 7 -1.27,-7.62; 8 1.27,-7.62; 9 3.81,-7.62; 10 6.35,-7.62; 11 8.89,-7.62; 12 11.43,-7.62; 13 13.97,-7.62; 14 16.51,-7.62; 15 16.51,7.62; 16 13.97,7.62; 17 11.43,7.62; 18 8.89,7.62; 19 6.35,7.62; 20 3.81,7.62; 21 1.27,7.62; 22 -1.27,7.62; 23 -3.81,7.62; 24 -6.35,7.62; 25 -8.89,7.62; 26 -11.43,7.62; 27 -13.97,7.62; 28 -16.51,7.62
DIL14 = drill 1.016 pad 1.778: 1 -7.62,-3.81; 2 -5.08,-3.81; 3 -2.54,-3.81; 4 0,-3.81; 5 2.54,-3.81; 6 5.08,-3.81; 7 7.62,-3.81; 8 7.62,3.81; 9 5.08,3.81; 10 2.54,3.81; 11 0,3.81; 12 -2.54,3.81; 13 -5.08,3.81; 14 -7.62,3.81
DIL16 = drill 1.016 pad 1.778: 1 -8.89,-3.81; 2 -6.35,-3.81; 3 -3.81,-3.81; 4 -1.27,-3.81; 5 1.27,-3.81; 6 3.81,-3.81; 7 6.35,-3.81; 8 8.89,-3.81; 9 8.89,3.81; 10 6.35,3.81; 11 3.81,3.81; 12 1.27,3.81; 13 -1.27,3.81; 14 -3.81,3.81; 15 -6.35,3.81; 16 -8.89,3.81
1X08 = drill 1.016 pad 1.778: 1 -8.89,0; 2 -6.35,0; 3 -3.81,0; 4 -1.27,0; 5 1.27,0; 6 3.81,0; 7 6.35,0; 8 8.89,0
TACTILE_SWITCH_PTH_6.0MM = drill 1.016 pad 1.88: 1 -3.251,2.261; 2 3.251,2.261; 3 -3.251,-2.261; 4 3.251,-2.261

### Placement (x,y rotation side)
C1  6.35,40.64 180 top
C2  44.45,11.43 180 top
C3  72.39,11.43 0 top
C6  30.48,87.63 90 top
C8  3.81,80.01 270 top
JP1  7.62,72.39 90 top
JP2  10.16,72.39 90 top
JP3  12.7,72.39 90 top
JP4  20.32,72.39 90 top
JP5  15.24,72.39 90 top
JP6  17.78,72.39 90 top
JP7  43.18,87.63 270 top
JP8  40.64,87.63 270 top
JP9  45.72,87.63 90 top
JP10  43.18,72.39 270 top
JP11  38.1,72.39 90 top
JP12  40.64,72.39 90 top
JP13  30.48,72.39 90 top
JP14  33.02,72.39 90 top
JP15  35.56,72.39 270 top
JP16  35.56,87.63 270 top
JP17  33.02,87.63 270 top
JP18  38.1,87.63 90 top
LED1  92.71,41.91 180 top
LED2  92.71,39.37 180 top
LED3  92.71,36.83 180 top
LED4  92.71,34.29 180 top
LED5  92.71,31.75 180 top
LED6  92.71,29.21 180 top
LED7  92.71,26.67 180 top
LED8  92.71,24.13 180 top
LED9  92.71,21.59 180 top
LED10  92.71,19.05 180 top
LED11  92.71,16.51 180 top
LED12  92.71,13.97 180 top
LED13  92.71,11.43 180 top
LED14  92.71,8.89 180 top
LED15  92.71,6.35 180 top
LED16  92.71,3.81 180 top
LED17  92.71,64.77 180 top
LED18  92.71,62.23 180 top
LED19  92.71,59.69 180 top
LED20  92.71,57.15 180 top
LED21  92.71,54.61 180 top
LED22  92.71,52.07 180 top
LED23  92.71,49.53 180 top
LED24  92.71,46.99 180 top
LED25  92.71,68.58 180 top
LED26  92.71,71.12 180 top
LED27  92.71,76.2 0 top
LED28  10.16,92.71 90 top
LED29  12.7,92.71 90 top
LED30  15.24,92.71 90 top
LED31  17.78,92.71 90 top
LED32  92.71,81.28 0 top
LED33  92.71,78.74 0 top
LED34  60.96,91.44 270 top
LED35  20.32,92.71 90 top
LED36  22.86,92.71 90 top
LED37  25.4,92.71 90 top
LED38  27.94,92.71 90 top
LED39  92.71,83.82 180 top
LED40  7.62,92.71 90 top
LED41  92.71,73.66 0 top
LOGO1  24.13,-16.51 0 top  (outside the outline)
M1  26.67,49.53 270 top
R1  6.35,55.88 0 top
R2  6.35,50.8 0 top
R3  6.35,45.72 0 top
R4  35.56,58.42 180 top
R5  10.16,96.52 90 top
R6  12.7,96.52 90 top
R7  15.24,96.52 90 top
R8  17.78,96.52 90 top
R9  20.32,96.52 90 top
R10  22.86,96.52 90 top
R11  25.4,96.52 90 top
R12  27.94,96.52 90 top
R13  7.62,96.52 90 top
R14  96.52,73.66 0 top
R18  96.52,81.28 0 top
R19  96.52,78.74 0 top
R20  60.96,95.25 90 top
R21  96.52,41.91 0 top
R22  96.52,39.37 0 top
R23  96.52,36.83 0 top
R24  96.52,34.29 0 top
R25  96.52,31.75 0 top
R26  96.52,29.21 0 top
R27  96.52,26.67 0 top
R28  96.52,24.13 0 top
R29  96.52,21.59 0 top
R30  96.52,19.05 0 top
R31  96.52,16.51 0 top
R32  96.52,13.97 0 top
R33  96.52,11.43 0 top
R34  96.52,8.89 0 top
R35  96.52,6.35 0 top
R36  96.52,3.81 0 top
R37  96.52,64.77 0 top
R38  96.52,62.23 0 top
R39  96.52,59.69 0 top
R40  96.52,57.15 0 top
R41  96.52,54.61 0 top
R42  96.52,52.07 0 top
R43  96.52,49.53 0 top
R44  96.52,46.99 0 top
R45  96.52,68.58 0 top
R46  96.52,71.12 0 top
R47  96.52,76.2 0 top
R60  96.52,83.82 0 top
U1  20.32,34.29 270 top
U2  53.34,31.75 90 top
U3  73.66,31.75 90 top
U5  38.1,80.01 0 top
U6  16.51,80.01 0 top
X1  88.9,33.02 270 top
X2  19.05,88.9 0 top
X5  88.9,77.47 90 top
X6  67.31,93.98 180 top
X7  77.47,93.98 180 top
X9  88.9,12.7 270 top
X10  88.9,55.88 270 top

### Tracks (layer width: path | path; a pad name or v marks a point on that pad's centre or on a via)
8000
  Top 0.4: LED28.C X2.1 10.16,85.72 U6.15
9000
  Top 0.4: LED29.C X2.2 U6.14
+5V  (via drill 0.5)
  Top 0.4: R4.1 v38.1,58.42 | X5.7 LED39.A 91.66,83.6 92.71,82.55 96.2,82.55 R18.2 R19.2 R47.2 R14.2
  Top 0.7: v45.72,12.7 45.72,11.75 C2.1
  Top 1: v45.72,12.7 v50.8,12.7 v58.42,12.7 v66.04,12.7 70.17,12.7 C3.1 | U1.8 C1.1 7.3,42.23 5.4,44.13 R3.1 R2.1 R1.1 5.4,60.01 7.62,62.23 v29.21,62.23 v38.1,62.23 v58.42,62.23 67.31,62.23 X5.7 | U5.14 C6.1 | C8.1 4.76,80.96 U6.16 5.08,86.36 5.08,96.52 6.03,97.47 R13.2 R5.2 R6.2 R7.2 R8.2 R9.2 R10.2 R11.2 R12.2
  Bottom 0.4: v38.1,58.42 v38.1,62.23 | U1.38 29.21,54.61 v29.21,62.23
  Bottom 1: U2.28 v45.72,12.7 | U3.28 v66.04,12.7 | M1.5V@2 M1.5V@1 v50.8,12.7 | v58.42,12.7 v58.42,62.23 | v29.21,62.23 29.21,75.29 28.94,75.56 28.94,81.28 | 28.94,81.28 28.94,82.28 U5.14 | U6.16 10.16,81.28 28.94,81.28
A0
  Top 0.4: U1.9 13.97,36.83 52.7,36.83 53.98,38.1 U2.10 62.23,38.1 63.5,36.83 73.66,36.83 74.93,38.1 U3.10 85.09,38.1 X1.1 LED1.A
  Bottom 0.4: M1.A8 U1.9
A000
  Top 0.4: LED30.C X2.3 U6.13
A1
  Top 0.4: U1.10 13.97,34.29 52.7,34.29 53.98,35.56 U2.9 62.23,35.56 63.5,34.29 74.93,34.29 76.2,35.56 U3.9 85.09,35.56 X1.2 LED2.A
  Bottom 0.4: M1.A9 U1.10
A2
  Top 0.4: U1.11 13.97,31.75 52.7,31.75 53.98,33.02 U2.8 62.23,33.02 63.5,31.75 74.93,31.75 76.2,33.02 U3.8 85.09,33.02 X1.3 LED3.A
  Bottom 0.4: M1.A10 U1.11
A3
  Top 0.4: U1.12 13.97,29.21 52.7,29.21 53.98,30.48 U2.7 62.23,30.48 63.5,29.21 80.01,29.21 U3.7 85.09,30.48 X1.4 LED4.A
  Bottom 0.4: M1.A11 U1.12
A4
  Top 0.4: U1.13 13.97,26.67 52.7,26.67 53.98,27.94 U2.6 62.23,27.94 63.5,26.67 73.66,26.67 74.93,27.94 U3.6 85.09,27.94 X1.5 LED5.A
  Bottom 0.4: M1.A12 U1.13
A5
  Top 0.4: U1.14 13.97,24.13 52.7,24.13 53.98,25.4 U2.5 62.23,25.4 63.5,24.13 73.66,24.13 74.93,25.4 U3.5 85.09,25.4 X1.6 LED6.A
  Bottom 0.4: M1.A13 U1.14
A6
  Top 0.4: U1.15 13.97,21.59 52.81,21.59 54.09,22.86 U2.4 62.23,22.86 63.5,21.59 73.66,21.59 74.93,22.86 U3.4 85.09,22.86 X1.7 LED7.A
  Bottom 0.4: M1.A14 U1.15
A7
  Top 0.4: U1.16 13.97,19.05 52.7,19.05 53.98,20.32 U2.3 62.23,20.32 63.5,19.05 73.66,19.05 74.93,20.32 U3.3 82.55,21.59 86.36,21.59 X1.8 LED8.A
  Bottom 0.4: M1.A15 9.85,16.76 U1.16
A8  (via drill 0.5)
  Top 0.4: U1.17 13.97,16.51 v43.18,16.51 | v43.18,22.86 U2.25 52.7,22.86 53.98,24.13 62.23,24.13 63.5,22.86 U3.25 73.66,22.86 74.93,24.13 v78.74,24.13 | LED9.A X9.1
  Bottom 0.4: v43.18,22.86 v43.18,16.51 | X9.1 80.01,21.59 78.74,22.86 v78.74,24.13 | U1.17 8.89,13.97 8.89,3.81 M1.53
A9  (via drill 0.5)
  Top 0.4: U1.18 13.97,13.97 v41.91,13.97 | v41.91,25.4 U2.24 52.7,25.4 53.98,26.67 62.23,26.67 63.5,25.4 U3.24 73.66,25.4 74.93,26.67 v77.47,26.67 | LED10.A X9.2
  Bottom 0.4: v41.91,25.4 v41.91,13.97 | v77.47,26.67 77.47,21.59 80.01,19.05 X9.2 | U1.18 10.16,12.7 M1.52
A10  (via drill 0.5)
  Top 0.4: U1.19 13.97,11.43 v39.37,11.43 | v39.37,33.02 U2.21 52.7,33.02 53.98,34.29 62.23,34.29 63.5,33.02 U3.21 v74.93,33.02 | LED11.A X9.3 87.63,16.51 85.09,19.05 v76.2,19.05
  Bottom 0.4: v39.37,33.02 v39.37,11.43 | v76.2,19.05 76.2,31.75 v74.93,33.02 | U1.19 11.43,11.43 11.43,3.81 M1.51
A11  (via drill 0.5)
  Top 0.4: U1.20 13.97,8.89 v40.64,8.89 | v40.64,27.94 U2.23 52.7,27.94 53.98,29.21 62.23,29.21 63.5,27.94 U3.23 v73.66,27.94 | LED12.A X9.4
  Bottom 0.4: v40.64,27.94 v40.64,8.89 | v73.66,27.94 74.93,26.67 74.93,17.78 76.2,16.51 86.36,16.51 X9.4 | U1.20 M1.50
A12  (via drill 0.5)
  Top 0.4: LED13.A X9.5 87.63,11.43 U3.2 74.93,17.78 73.66,16.51 63.5,16.51 62.23,17.78 U2.2 53.34,17.78 49.53,13.97 43.18,13.97 41.91,12.7 U1.22 v14.07,12.7 | v7.62,69.85 JP1.1
  Bottom 0.4: M1.49 14,3.78 14,5.59 14.07,5.66 v14.07,12.7 14.07,45.82 15.24,46.99 15.24,62.23 v7.62,69.85
A13  (via drill 0.5)
  Top 0.4: v44.45,20.32 U2.26 52.7,20.32 53.98,21.59 62.23,21.59 63.5,20.32 U3.26 v73.66,20.32 | v43.18,15.24 U1.23 v15.24,15.24 | LED14.A X9.6 | v10.16,69.85 JP2.1
  Bottom 0.4: v44.45,20.32 44.45,16.51 v43.18,15.24 | v73.66,20.32 73.66,17.78 77.47,13.97 83.82,13.97 X9.6 | M1.48 v15.24,15.24 15.24,43.18 15.24,45.72 16.51,46.99 16.51,63.5 v10.16,69.85
A14  (via drill 0.5)
  Top 0.4: v52.07,15.24 U2.1 62.23,15.24 63.5,13.97 80.01,13.97 U3.1 81.28,10.79 85.72,6.35 X9.7 LED15.A | v50.8,16.51 44.45,16.51 43.18,17.78 U1.24 v16.51,17.78 | v12.7,69.85 JP3.1
  Bottom 0.4: v52.07,15.24 v50.8,16.51 | M1.47 16.51,3.81 v16.51,17.78 16.51,45.72 17.78,46.99 17.78,64.77 v12.7,69.85
A15  (via drill 0.5)
  Top 0.4: LED16.A X9.8 86.36,3.81 82.55,7.62 v17.78,7.62 | 21.59,71.63 JP4.1 v20.32,69.85 | 21.59,71.63 JP13.1 JP14.1 | LED40.C 8.89,90.39 8.89,81.92 10.79,80.01 19.68,80.01 21.59,78.11 21.59,71.63 | U1.25 v17.78,20.32
  Bottom 0.4: M1.46 v17.78,7.62 v17.78,20.32 17.78,45.72 19.05,46.99 19.05,66.04 20.32,67.31 v20.32,69.85
B000
  Top 0.4: LED31.C X2.4 U6.12
C000
  Top 0.4: LED35.C X2.5 U6.11
D0  (via drill 0.5)
  Top 0.4: U3.11 v76.2,40.64 74.93,40.64 73.66,39.37 63.5,39.37 62.23,40.64 U2.11 53.98,40.64 52.7,39.37 v29.21,39.37 U1.33 | v76.2,49.53 76.2,52.07 X10.1 LED17.A
  Bottom 0.4: v76.2,49.53 v76.2,40.64 | M1.37 29.21,3.81 v29.21,39.37
D000
  Top 0.4: LED36.C X2.6 U6.10
D1  (via drill 0.5)
  Top 0.4: U3.12 v77.47,43.18 74.93,43.18 73.66,41.91 63.5,41.91 62.23,43.18 U2.12 53.98,43.18 52.7,41.91 v30.48,41.91 | v30.48,38.1 U1.32 | v77.47,49.53 77.47,50.8 X10.2 LED18.A
  Bottom 0.4: v30.48,41.91 30.48,39.37 v30.48,38.1 M1.36 | v77.47,49.53 v77.47,43.18
D2  (via drill 0.5)
  Top 0.4: U3.13 74.93,45.72 73.66,44.45 63.5,44.45 62.23,45.72 U2.13 53.98,45.72 52.7,44.45 v34.29,44.45 | v31.75,35.56 U1.31 | v78.74,49.53 X10.3 LED19.A
  Bottom 0.4: v78.74,49.53 78.74,46.35 79.38,45.72 U3.13 | M1.35 31.75,3.81 v31.75,35.56 31.75,41.91 v34.29,44.45
D3  (via drill 0.5)
  Top 0.4: v33.02,33.02 U1.30 | v39.37,48.26 U2.15 52.7,48.26 53.98,49.53 62.23,49.53 63.5,48.26 U3.15 78.74,48.26 87.63,57.15 X10.4 LED20.A
  Bottom 0.4: M1.34 v33.02,33.02 33.02,41.91 v39.37,48.26
D4  (via drill 0.5)
  Top 0.4: v34.29,30.48 U1.29 | v39.37,45.72 U2.16 52.7,45.72 53.98,46.99 62.23,46.99 63.5,45.72 U3.16 73.66,45.72 74.93,46.99 82.55,46.99 87,51.44 87,52.7 X10.5 LED21.A
  Bottom 0.4: M1.33 34.29,3.81 v34.29,30.48 34.29,40.64 v39.37,45.72
D5  (via drill 0.5)
  Top 0.4: v35.56,27.94 U1.28 | v39.37,43.18 U2.17 52.7,43.18 53.98,44.45 62.23,44.45 63.5,43.18 U3.17 73.66,43.18 74.93,44.45 81.77,44.45 88.9,51.58 X10.6 LED22.A
  Bottom 0.4: M1.32 v35.56,27.94 35.56,39.37 v39.37,43.18
D6  (via drill 0.5)
  Top 0.4: v36.83,25.4 U1.27 | v39.37,40.64 U2.18 52.7,40.64 53.98,41.91 62.23,41.91 63.5,40.64 U3.18 73.66,40.64 74.93,41.91 82.55,41.91 86.36,45.72 86.36,46.99 X10.7 LED23.A
  Bottom 0.4: M1.31 36.86,3.78 36.86,25.37 v36.83,25.4 36.83,38.1 v39.37,40.64
D7  (via drill 0.5)
  Top 0.4: v38.1,22.86 U1.26 | v38.1,38.1 U2.19 52.7,38.1 53.98,39.37 62.23,39.37 63.5,38.1 U3.19 73.66,38.1 74.93,39.37 v77.47,39.37 | LED24.A X10.8
  Bottom 0.4: v38.1,38.1 v38.1,22.86 M1.30 | v77.47,39.37 80.01,41.91 85.09,41.91 85.09,43.18 X10.8
E000  (via drill 0.5)
  Top 0.4: JP16.1 v35.56,91.44 | LED37.C X2.7 U6.9
  Bottom 0.4: v35.56,91.44 27.94,91.44 X2.7
EEPROM_!CS  (via drill 0.5)
  Top 0.4: JP9.2 46.48,88.39 v46.99,88.9
  Bottom 0.4: U2.20 46.99,36.83 v46.99,88.9
EEPROM_!OE  (via drill 0.5)
  Top 0.4: v11.43,54.61 11.46,54.64 13.21,54.64 18.27,59.69 v48.26,59.69
  Bottom 0.4: M1.A1 v11.43,54.61 | U2.22 48.26,33.02 v48.26,59.69
EEPROM_!WE  (via drill 0.5)
  Top 0.4: v11.43,57.15 13.97,57.15 17.78,60.96 v49.53,60.96
  Bottom 0.4: M1.A0 v11.43,57.15 | U2.27 49.53,21.59 v49.53,60.96
F000  (via drill 0.5)
  Top 0.4: U6.7 27.94,81.28 X2.8 LED38.C | JP17.1 v33.02,90.17
  Bottom 0.4: v33.02,90.17 29.21,90.17 X2.8
GND
  pour Bottom: -2.54,101.6 162.56,101.6 162.56,-2.54 -2.54,-2.54
  pour Top: -1.27,100.33 163.83,100.33 163.83,-3.81 -1.27,-3.81
HALT_BTN  (via drill 0.5)
  Top 0.4: X7.1 X7.2 71.12,88.62 71.12,68.58 67.31,64.77 v22.86,64.77
  Bottom 0.4: M1.42 v22.86,64.77
HALT_LED  (via drill 0.5)
  Top 0.4: LED34.A 60.96,66.04 v21.59,66.04
  Bottom 0.4: M1.43 21.59,3.81 v21.59,66.04
IRQB
  Top 0.4: R2.2 U1.4 13.97,49.53 34.29,49.53 40.64,55.88 68.58,55.88 X5.4 LED27.C
  Bottom 0.4: M1.A3 U1.4
N$1
  Top 0.4: LED40.A R13.1
N$2
  Top 0.4: R14.1 LED41.A
N$3  (via drill 1.02 pad 1.78)
  other vias: 19.05,142.24
N$4  (via drill 1.02 pad 1.78)
  other vias: 19.05,139.7
N$5  (via drill 1.02 pad 1.78)
  other vias: 19.05,137.16
N$7  (via drill 1.02 pad 1.78)
  other vias: 19.05,134.62
N$8  (via drill 1.02 pad 1.78)
  other vias: 21.59,142.24
N$9
  Top 0.4: U5.9 JP7.2
N$10
  Top 0.4: U5.10 JP8.2
N$11
  Top 0.4: U5.8 JP9.1
N$12
  Top 0.4: JP1.2 U6.1
N$13
  Top 0.4: JP2.2 U6.2
N$14
  Top 0.4: JP3.2 U6.3
N$15
  Top 0.4: JP5.2 U6.4
N$16
  Top 0.4: JP6.2 U6.5
N$17
  Top 0.4: JP4.2 U6.6
N$18
  Top 0.4: U5.13 JP17.2
N$19
  Top 0.4: JP10.1 U5.6
N$20
  Top 0.4: JP13.2 U5.1
N$21
  Top 0.4: JP14.2 U5.2
N$22
  Top 0.4: R21.1 LED1.C
N$23
  Top 0.4: R22.1 LED2.C
N$24
  Top 0.4: R23.1 LED3.C
N$25
  Top 0.4: R24.1 LED4.C
N$26
  Top 0.4: R25.1 LED5.C
N$27
  Top 0.4: R26.1 LED6.C
N$28
  Top 0.4: R27.1 LED7.C
N$29
  Top 0.4: R28.1 LED8.C
N$30
  Top 0.4: R29.1 LED9.C
N$31
  Top 0.4: R30.1 LED10.C
N$32
  Top 0.4: R31.1 LED11.C
N$33
  Top 0.4: R32.1 LED12.C
N$34
  Top 0.4: R33.1 LED13.C
N$35
  Top 0.4: R34.1 LED14.C
N$36
  Top 0.4: R35.1 LED15.C
N$37
  Top 0.4: R36.1 LED16.C
N$38
  Top 0.4: R37.1 LED17.C
N$39
  Top 0.4: R38.1 LED18.C
N$40
  Top 0.4: R39.1 LED19.C
N$41
  Top 0.4: R40.1 LED20.C
N$42
  Top 0.4: R41.1 LED21.C
N$43
  Top 0.4: R42.1 LED22.C
N$44
  Top 0.4: R43.1 LED23.C
N$45
  Top 0.4: R44.1 LED24.C
N$46
  Top 0.4: R45.1 LED25.C
N$47
  Top 0.4: R46.1 LED26.C
N$48
  Top 0.4: R47.1 LED27.A
N$49
  Top 0.4: JP15.1 U5.3
N$50
  Top 0.4: U5.11 JP18.1
N$51
  Top 0.4: JP15.2 JP11.1
N$52
  Top 0.4: U5.12 JP16.2
N$53
  Top 0.4: JP18.2 JP8.1 JP7.1
N$54
  Top 0.4: R60.1 LED39.C
N$55
  Top 0.4: JP11.2 U5.4
N$56
  Top 0.4: JP12.2 U5.5
N$57
  Top 0.4: LED28.A R5.1
N$58
  Top 0.4: LED29.A R6.1
N$59
  Top 0.4: LED30.A R7.1
N$60
  Top 0.4: LED31.A R8.1
N$61
  Top 0.4: LED35.A R9.1
N$62
  Top 0.4: LED36.A R10.1
N$63
  Top 0.4: LED37.A R11.1
N$64
  Top 0.4: LED38.A R12.1
N$65
  Top 0.4: R18.1 LED32.A
N$66
  Top 0.4: R19.1 LED33.A
N$67
  Top 0.4: LED34.C R20.1
N$68  (via drill 1.02 pad 1.78)
  other vias: 21.59,139.7
N$69  (via drill 1.02 pad 1.78)
  other vias: 21.59,137.16
N$70  (via drill 1.02 pad 1.78)
  other vias: 21.59,134.62
N$71  (via drill 1.02 pad 1.78)
  other vias: 24.13,142.24
N$72  (via drill 1.02 pad 1.78)
  other vias: 24.13,139.7
N$73  (via drill 1.02 pad 1.78)
  other vias: 24.13,137.16
N$74  (via drill 1.02 pad 1.78)
  other vias: 24.13,134.62
N$75  (via drill 1.02 pad 1.78)
  other vias: 24.13,132.08
N$76  (via drill 1.02 pad 1.78)
  other vias: 24.13,129.54
N$77  (via drill 1.02 pad 1.78)
  other vias: 24.13,127
N$78  (via drill 1.02 pad 1.78)
  other vias: 24.13,124.46
N$79  (via drill 1.02 pad 1.78)
  other vias: 21.59,124.46
N$80  (via drill 1.02 pad 1.78)
  other vias: 19.05,124.46
N$81  (via drill 1.02 pad 1.78)
  other vias: 19.05,121.92
N$82  (via drill 1.02 pad 1.78)
  other vias: 21.59,121.92
N$83  (via drill 1.02 pad 1.78)
  other vias: 24.13,121.92
N$84  (via drill 1.02 pad 1.78)
  other vias: 24.13,119.38
N$85  (via drill 1.02 pad 1.78)
  other vias: 21.59,119.38
N$86  (via drill 1.02 pad 1.78)
  other vias: 19.05,119.38
N$87  (via drill 1.02 pad 1.78)
  other vias: 19.05,116.84
N$88  (via drill 1.02 pad 1.78)
  other vias: 21.59,116.84
N$89  (via drill 1.02 pad 1.78)
  other vias: 24.13,116.84
N$90  (via drill 1.02 pad 1.78)
  other vias: 24.13,114.3
N$91  (via drill 1.02 pad 1.78)
  other vias: 21.59,114.3
N$92  (via drill 1.02 pad 1.78)
  other vias: 19.05,114.3
N$93  (via drill 1.02 pad 1.78)
  other vias: 26.67,142.24
N$94  (via drill 1.02 pad 1.78)
  other vias: 26.67,139.7
N$95  (via drill 1.02 pad 1.78)
  other vias: 26.67,137.16
N$96  (via drill 1.02 pad 1.78)
  other vias: 26.67,134.62
N$97  (via drill 1.02 pad 1.78)
  other vias: 26.67,132.08
N$98  (via drill 1.02 pad 1.78)
  other vias: 26.67,129.54
N$99  (via drill 1.02 pad 1.78)
  other vias: 26.67,127
N$100  (via drill 1.02 pad 1.78)
  other vias: 26.67,124.46
N$101  (via drill 1.02 pad 1.78)
  other vias: 26.67,121.92
N$102  (via drill 1.02 pad 1.78)
  other vias: 26.67,119.38
N$103  (via drill 1.02 pad 1.78)
  other vias: 26.67,116.84
N$104  (via drill 1.02 pad 1.78)
  other vias: 26.67,114.3
N$105  (via drill 1.02 pad 1.78)
  other vias: 29.21,142.24
N$106  (via drill 1.02 pad 1.78)
  other vias: 29.21,139.7
N$107  (via drill 1.02 pad 1.78)
  other vias: 29.21,137.16
N$108  (via drill 1.02 pad 1.78)
  other vias: 29.21,134.62
N$109  (via drill 1.02 pad 1.78)
  other vias: 29.21,132.08
N$110  (via drill 1.02 pad 1.78)
  other vias: 29.21,129.54
N$111  (via drill 1.02 pad 1.78)
  other vias: 29.21,127
N$112  (via drill 1.02 pad 1.78)
  other vias: 29.21,124.46
N$113  (via drill 1.02 pad 1.78)
  other vias: 29.21,121.92
N$114  (via drill 1.02 pad 1.78)
  other vias: 29.21,119.38
N$115  (via drill 1.02 pad 1.78)
  other vias: 29.21,116.84
N$116  (via drill 1.02 pad 1.78)
  other vias: 29.21,114.3
N$117  (via drill 1.02 pad 1.78)
  other vias: 31.75,142.24
N$118  (via drill 1.02 pad 1.78)
  other vias: 31.75,139.7
N$119  (via drill 1.02 pad 1.78)
  other vias: 31.75,137.16
N$120  (via drill 1.02 pad 1.78)
  other vias: 31.75,134.62
N$121  (via drill 1.02 pad 1.78)
  other vias: 31.75,132.08
N$122  (via drill 1.02 pad 1.78)
  other vias: 31.75,129.54
N$123  (via drill 1.02 pad 1.78)
  other vias: 31.75,127
N$124  (via drill 1.02 pad 1.78)
  other vias: 31.75,124.46
N$125  (via drill 1.02 pad 1.78)
  other vias: 31.75,121.92
N$126  (via drill 1.02 pad 1.78)
  other vias: 31.75,119.38
N$127  (via drill 1.02 pad 1.78)
  other vias: 31.75,116.84
N$128  (via drill 1.02 pad 1.78)
  other vias: 31.75,114.3
N$129  (via drill 1.02 pad 1.78)
  other vias: 34.29,142.24
N$130  (via drill 1.02 pad 1.78)
  other vias: 34.29,139.7
N$131  (via drill 1.02 pad 1.78)
  other vias: 34.29,137.16
N$132  (via drill 1.02 pad 1.78)
  other vias: 34.29,134.62
N$133  (via drill 1.02 pad 1.78)
  other vias: 34.29,132.08
N$134  (via drill 1.02 pad 1.78)
  other vias: 34.29,129.54
N$135  (via drill 1.02 pad 1.78)
  other vias: 34.29,127
N$136  (via drill 1.02 pad 1.78)
  other vias: 34.29,124.46
N$137  (via drill 1.02 pad 1.78)
  other vias: 34.29,121.92
N$138  (via drill 1.02 pad 1.78)
  other vias: 34.29,119.38
N$139  (via drill 1.02 pad 1.78)
  other vias: 34.29,116.84
N$140  (via drill 1.02 pad 1.78)
  other vias: 34.29,114.3
N$141  (via drill 1.02 pad 1.78)
  other vias: 36.83,142.24
N$142  (via drill 1.02 pad 1.78)
  other vias: 36.83,139.7
N$143  (via drill 1.02 pad 1.78)
  other vias: 36.83,137.16
N$144  (via drill 1.02 pad 1.78)
  other vias: 36.83,134.62
N$145  (via drill 1.02 pad 1.78)
  other vias: 36.83,132.08
N$146  (via drill 1.02 pad 1.78)
  other vias: 36.83,129.54
N$147  (via drill 1.02 pad 1.78)
  other vias: 36.83,127
N$148  (via drill 1.02 pad 1.78)
  other vias: 36.83,124.46
N$149  (via drill 1.02 pad 1.78)
  other vias: 36.83,121.92
N$150  (via drill 1.02 pad 1.78)
  other vias: 36.83,119.38
N$151  (via drill 1.02 pad 1.78)
  other vias: 36.83,116.84
N$153  (via drill 1.02 pad 1.78)
  other vias: 39.37,142.24
N$154  (via drill 1.02 pad 1.78)
  other vias: 39.37,139.7
N$155  (via drill 1.02 pad 1.78)
  other vias: 39.37,137.16
N$156  (via drill 1.02 pad 1.78)
  other vias: 39.37,134.62
N$157  (via drill 1.02 pad 1.78)
  other vias: 39.37,132.08
N$158  (via drill 1.02 pad 1.78)
  other vias: 39.37,129.54
N$159  (via drill 1.02 pad 1.78)
  other vias: 39.37,127
N$160  (via drill 1.02 pad 1.78)
  other vias: 39.37,124.46
N$161  (via drill 1.02 pad 1.78)
  other vias: 39.37,121.92
N$162  (via drill 1.02 pad 1.78)
  other vias: 39.37,119.38
N$165  (via drill 1.02 pad 1.78)
  other vias: 41.91,142.24
N$166  (via drill 1.02 pad 1.78)
  other vias: 41.91,139.7
N$167  (via drill 1.02 pad 1.78)
  other vias: 41.91,137.16
N$168  (via drill 1.02 pad 1.78)
  other vias: 41.91,134.62
N$169  (via drill 1.02 pad 1.78)
  other vias: 41.91,132.08
N$170  (via drill 1.02 pad 1.78)
  other vias: 41.91,129.54
N$171  (via drill 1.02 pad 1.78)
  other vias: 41.91,127
N$172  (via drill 1.02 pad 1.78)
  other vias: 41.91,124.46
N$173  (via drill 1.02 pad 1.78)
  other vias: 41.91,121.92
NMIB
  Top 0.4: R3.2 U1.6 13.97,46.99 33.02,46.99 39.37,53.34 68.58,53.34 X5.3 LED41.C
  Bottom 0.4: M1.A5 U1.6
PHI2  (via drill 0.5)
  Top 0.4: v20.32,50.8 U1.37 34.29,50.8 v40.64,57.15 67.31,57.15 X5.5 LED33.C | JP12.1 v40.64,69.85
  Bottom 0.4: M1.44 v20.32,50.8 | v40.64,69.85 v40.64,57.15
RAM_!CS  (via drill 0.5)
  Top 0.4: JP10.2 v43.18,69.85 | v43.18,63.5 v63.5,63.5
  Bottom 0.4: v43.18,69.85 v43.18,63.5 | v63.5,63.5 63.5,38.1 | 63.5,38.1 U3.20 | 63.5,38.1 63.5,33.02 U3.22
RDY_BE  (via drill 0.5)
  Top 0.4: R1.2 10.16,55.88 U1.2 | v14.59,48.26 U1.36
  Bottom 0.4: U1.2 14.07,54.51 14.59,53.99 v14.59,48.26 13.32,46.99 11.43,46.99 M1.A4
RESB  (via drill 0.5)
  Top 0.4: v11.43,52.07 13.97,52.07 20.32,58.42 U1.40 R4.2 35.88,57.15 39.37,57.15 40.64,58.42 66.04,58.42 X5.6 LED32.C | X6.1 X6.2
  Bottom 0.4: v11.43,52.07 M1.A2 | X6.1 77.19,91.72 87.63,81.28 X5.6
RWB  (via drill 0.5)
  Top 0.4: v11.43,41.91 13.97,41.91 15.24,43.18 U1.34 31.75,43.18 39.37,50.8 v68.58,50.8 71.12,50.8 X5.1 LED25.A
  Bottom 0.4: v11.43,41.91 11.43,39.37 M1.A7 | U3.27 68.58,20.32 v68.58,50.8
SYNC
  Top 0.4: U1.7 13.97,44.45 31.75,44.45 39.37,52.07 69.85,52.07 X5.2 LED26.A
  Bottom 0.4: M1.A6 10.16,40.64 10.16,41.91 11.43,43.18 U1.7

### Text on the board
tPlace: LCD | SINGLE STEP | RESET | RAM | 80 | 90 | A0 | B0 | C0 | D0 | E0 | F0 | GND | 5 V | RESET | PHI2 | IRQ | 74x138 | 74x00 | NMI | SYNC | R!W | ADDRESS DECODING | 0 | 1 | MICROPROCESSOR | 2 | !VP | !RES | 3 | RDY | PHI2O | 4 | PHI1 | SOB | EEPROM | RAM | 5 | !IRQ | PHI2 | 28C256 | 62256 | 6 | !ML | BE | 7 | !NMI | SYNC | R!W | 0 | VDD | D0 | 1 | A0 | D1 | 2 | A1 | D2 | 3 | A2 | D3 | 4 | A3 | D4 | 5 | A4 | D5 | 6 | A5 | D6 | 7 | A6 | D7 | 8 | A7 | A15 | 9 | A8 | A14 | 10 | A9 | A13 | 11 | A10 | A12 | 12 | A11 | VSS | 13 | W65C02 | 14 | 15 | RF-6502 | V1.0 | R. Fromm | 01-2021